# Altium schematic sheet FMC.SchDoc: FMC HPC
size B; CompanyName: Cospan Design; DrawnBy: David McCoy; Engineer: David McCoy; DocumentNumber: 14; SheetNumber: 14; SheetTotal: 26; Project: Prometheus; SheetName: FMC HPC; ProjectPrettyName: Prometheus
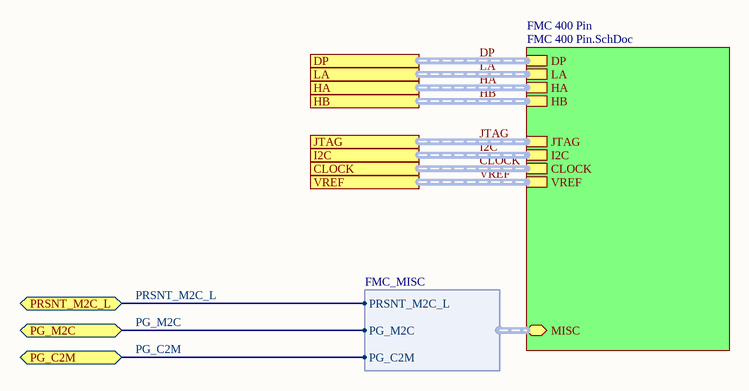
[diagram p0: FMC.SchDoc]

## Sub-sheets
FMC 400 Pin = FMC 400 Pin.SchDoc: DP (harness FMC_J1_DP), LA (harness FMC_J1_LA), HA (harness FMC_J1_HA), HB (harness FMC_J1_HB), JTAG (harness FMC_J1_JTAG), I2C (harness FMC_J1_I2C), CLOCK (harness FMC_J1_CLOCK), VREF (harness FMC_J1_VREF), MISC (harness FMC_MISC)

## Ports
CLOCK (harness FMC_J1_CLOCK), DP (harness FMC_J1_DP), HA (harness FMC_J1_HA), HB (harness FMC_J1_HA), I2C (harness FMC_J1_I2C), JTAG (harness FMC_J1_JTAG), LA (harness FMC_J1_LA), PG_C2M, PG_M2C, PRSNT_M2C_L, VREF (harness FMC_J1_VREF)

## Harnesses
FMC_MISC: PRSNT_M2C_L, PG_M2C, PG_C2M

## Nets
PG_C2M: port PG_C2M, sheet FMC 400 Pin/MISC.PG_C2M
PG_M2C: port PG_M2C, sheet FMC 400 Pin/MISC.PG_M2C
PRSNT_M2C_L: port PRSNT_M2C_L, sheet FMC 400 Pin/MISC.PRSNT_M2C_L

## Buses and harness runs
harness CLOCK = port CLOCK = sheet FMC 400 Pin/CLOCK
harness DP = port DP = sheet FMC 400 Pin/DP
harness HA = port HA = sheet FMC 400 Pin/HA
harness HB = port HB = sheet FMC 400 Pin/HB
harness I2C = port I2C = sheet FMC 400 Pin/I2C
harness JTAG = port JTAG = sheet FMC 400 Pin/JTAG
harness LA = port LA = sheet FMC 400 Pin/LA
harness VREF = port VREF = sheet FMC 400 Pin/VREF

## Notes on the sheet
- Title:
- http://www.cospandesign.com
- Cospan Design
- Project:
- Document:
- Engineer:
- Drawn By:
- Approved By:
- Revision:
- Date:
- Number:
- of